# EAGLE design pcb_univ_3-2-(1-2)-x-rev2 (EAGLE 7.5.0)
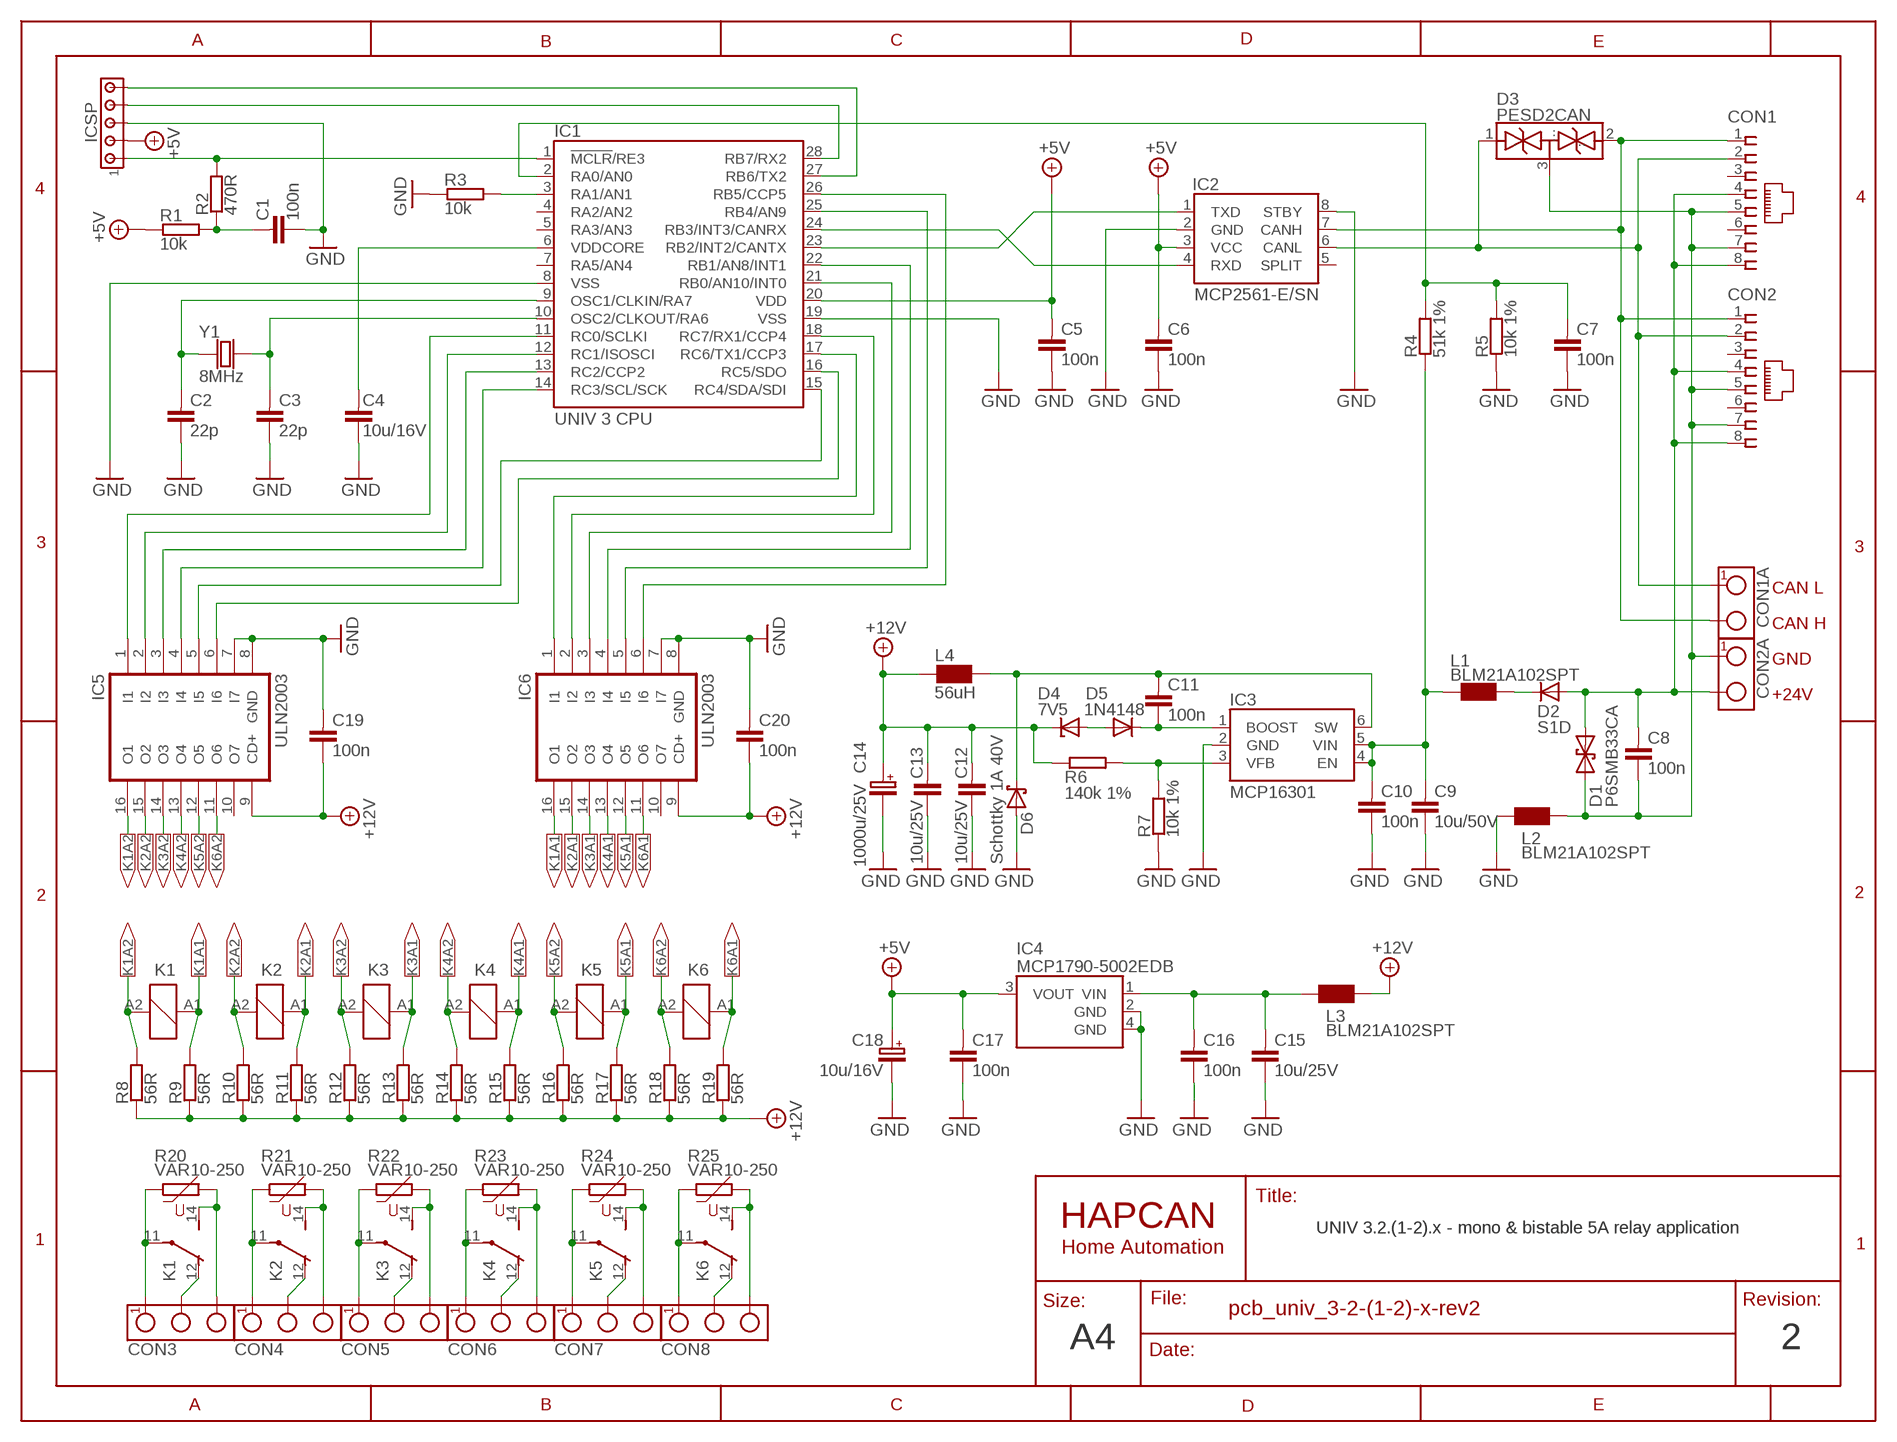
[diagram p0: schematic, sheet 1]
FRAME (HAP_A4): AUTHOR: hapcan.com

## Parts
C1  100n  CAPACITOR0805  [0805]
C2  22p  CAPACITOR0805  [0805]
C3  22p  CAPACITOR0805  [0805]
C4  10u/16V  CAPACITOR0805  [0805]
C5  100n  CAPACITOR0805  [0805]
C6  100n  CAPACITOR0805  [0805]
C7  100n  CAPACITOR0805  [0805]
C8  100n  CAPACITOR0805  [0805]
C9  10u/50V  CAPACITOR1210  [1210]
C10  100n  CAPACITOR0805  [0805]
C11  100n  CAPACITOR0805  [0805]
C12  10u/25V  CAPACITOR1206  [1206]
C13  10u/25V  CAPACITOR1206  [1206]
C14  1000u/25V  CAPACITOR-POLARIZED-5X10.5  [CAP-5X10.5]
C15  10u/25V  CAPACITOR1206  [1206]
C16  100n  CAPACITOR0805  [0805]
C17  100n  CAPACITOR0805  [0805]
C18  10u/16V  CAPACITOR-POLARIZED-SMC_B  [SMC_B]
C19  100n  CAPACITOR0805  [0805]
C20  100n  CAPACITOR0805  [0805]
CON1  RJ45-SOCKET  [RJ45-PCB-SOCKET]
CON1A  TERMINAL-2  TERMINAL-2-5X10,5MM  [ARK2-5X10,5MM]
CON2  RJ45-SOCKET  [RJ45-PCB-SOCKET]
CON2A  TERMINAL-2  TERMINAL-2-5X10,5MM  [ARK2-5X10,5MM]
CON3  TERMINAL-3-5X10.5MM  [ARK3-5X10.5MM]
CON4  TERMINAL-3-5X10.5MM  [ARK3-5X10.5MM]
CON5  TERMINAL-3-5X10.5MM  [ARK3-5X10.5MM]
CON6  TERMINAL-3-5X10.5MM  [ARK3-5X10.5MM]
CON7  TERMINAL-3-5X10.5MM  [ARK3-5X10.5MM]
CON8  TERMINAL-3-5X10.5MM  [ARK3-5X10.5MM]
D1  P6SMB33CA  DIODE_TRANSIL2  [DO-214_TRANSIL2]
D2  S1D  DIODE_DO-214  [DO-214]
D3  PESD2CAN  PESD2CANSOT-23  [SOT-23]
D4  7V5  DIODE_ZENER_SOD-80  [SOD-80]
D5  1N4148  DIODE_0805  [0805]
D6  Schottky 1A 40V  DIODE_TRANSIL1_DO214  [DO-214]
IC1  UNIV 3 CPU  UNIV3CPU-I/SO  [UNIV3CPU]
IC2  MCP2561-E/SN  [SO-08]
IC3  MCP16301  MCP16301SOT23-6  [SOT-23-6]
IC4  MCP1790-5002EDB  MCP1826SOT223-3  [SOT-223]
IC5  ULN2003  [SO-16]
IC6  ULN2003  [SO-16]
ICSP  HEADER5  [SIP-5]
K1  RELAY_PE  [RELAY_PE]
K2  RELAY_PE  [RELAY_PE]
K3  RELAY_PE  [RELAY_PE]
K4  RELAY_PE  [RELAY_PE]
K5  RELAY_PE  [RELAY_PE]
K6  RELAY_PE  [RELAY_PE]
L1  BLM21A102SPT  CHOKE0805  [0805]
L2  BLM21A102SPT  CHOKE0805  [0805]
L3  BLM21A102SPT  CHOKE0805  [0805]
L4  56uH  CHOKEDER0705  [CHOKE-DER0705]
R1  10k  RESISTOR0805  [0805]
R2  470R  RESISTOR0805  [0805]
R3  10k  RESISTOR0805  [0805]
R4  51k 1%  RESISTOR0805  [0805]
R5  10k 1%  RESISTOR0805  [0805]
R6  140k 1%  RESISTOR0805  [0805]
R7  10k 1%  RESISTOR0805  [0805]
R8  56R  RESISTOR1206  [1206]
R9  56R  RESISTOR1206  [1206]
R10  56R  RESISTOR1206  [1206]
R11  56R  RESISTOR1206  [1206]
R12  56R  RESISTOR1206  [1206]
R13  56R  RESISTOR1206  [1206]
R14  56R  RESISTOR1206  [1206]
R15  56R  RESISTOR1206  [1206]
R16  56R  RESISTOR1206  [1206]
R17  56R  RESISTOR1206  [1206]
R18  56R  RESISTOR1206  [1206]
R19  56R  RESISTOR1206  [1206]
R20  VAR10-250  VARISTOR7.5MM-1  [VARISTOR1]
R21  VAR10-250  VARISTOR7.5MM-1  [VARISTOR1]
R22  VAR10-250  VARISTOR7.5MM-1  [VARISTOR1]
R23  VAR10-250  VARISTOR7.5MM-1  [VARISTOR1]
R24  VAR10-250  VARISTOR7.5MM-1  [VARISTOR1]
R25  VAR10-250  VARISTOR7.5MM-1  [VARISTOR1]
Y1  8MHz  CRYSTAL-HC49V  [CRYSTAL-HC49V]

## Nets
+5V: C5.1 C6.1 C17.1 C18.+ IC1.20(VDD) IC2.3(VCC) IC4.3(VOUT) ICSP.2 R1.1
+12V: C12.1 C13.1 C14.+ C19.2 C20.2 D4.C IC5.9(CD+) IC6.9(CD+) L3.2 L4.1 R6.1 R8.1 R9.1 R10.1 R11.1 R12.1 R13.1 R14.1 R15.1 R16.1 R17.1 R18.1 R19.1
GND: C1.2 C2.2 C3.2 C4.2 C5.2 C6.2 C7.2 C9.2 C10.2 C12.2 C13.2 C14.- C15.2 C16.2 C17.2 C18.- C19.1 C20.1 D6.A IC1.8(VSS) IC1.19(VSS) IC2.2(GND) IC2.8(STBY) IC3.2(GND) IC4.2(GND) IC4.4(GND) IC5.7(I7) IC5.8(GND) IC6.7(I7) IC6.8(GND) ICSP.3 L2.1 R3.1 R5.1 R7.1
K1A1: IC6.16(O1) K1.A1 R9.2
K1A2: IC5.16(O1) K1.A2 R8.2
K2A1: IC6.15(O2) K2.A1 R11.2
K2A2: IC5.15(O2) K2.A2 R10.2
K3A1: IC6.14(O3) K3.A1 R13.2
K3A2: IC5.14(O3) K3.A2 R12.2
K4A1: IC6.13(O4) K4.A1 R15.2
K4A2: IC5.13(O4) K4.A2 R14.2
K5A1: IC6.12(O5) K5.A1 R17.2
K5A2: IC5.12(O5) K5.A2 R16.2
K6A1: IC6.11(O6) K6.A1 R19.2
K6A2: IC5.11(O6) K6.A2 R18.2
N$1: D2.C L1.2
N$2: IC1.24(RB3/INT3/CANRX) IC2.4(RXD)
N$3: IC1.23(RB2/INT2/CANTX) IC2.1(TXD)
N$4: CON1.1 CON1A.2 CON2.1 D3.2(..) IC2.7(CANH)
N$5: C9.1 C10.1 IC3.4(EN) IC3.5(VIN) L1.1 R4.1
N$6: C15.1 C16.1 IC4.1(VIN) L3.1
N$7: C1.1 R1.2 R2.1
N$8: IC1.1(!MCLR!/RE3) ICSP.1 R2.2
N$9: C8.1 CON1.4 CON1.8 CON2.4 CON2.8 CON2A.2 D1.C D2.A
N$10: IC1.28(RB7/RX2) ICSP.4
N$11: IC1.12(RC1/ISOSCI) IC5.2(I2)
N$12: IC1.3(RA1/AN1) R3.2
N$13: C8.2 CON1.5 CON1.7 CON2.5 CON2.7 CON2A.1 D1.A D3.3(...) L2.2
N$14: IC1.27(RB6/TX2) ICSP.5
N$15: C3.1 IC1.10(OSC2/CLKOUT/RA6) Y1.2
N$16: C7.1 IC1.2(RA0/AN0) R4.2 R5.2
N$17: C11.1 D6.C IC3.6(SW) L4.2
N$18: IC1.11(RC0/SCLKI) IC5.1(I1)
N$19: IC1.13(RC2/CCP2) IC5.3(I3)
N$20: IC3.3(VFB) R6.2 R7.2
N$21: CON3.2 K1.12(2:NC)
N$22: IC1.14(RC3/SCL/SCK) IC5.4(I4)
N$23: D4.A D5.2(A)
N$24: IC1.15(RC4/SDA/SDI) IC5.5(I5)
N$25: CON4.2 K2.12(2:NC)
N$26: CON5.2 K3.12(2:NC)
N$27: CON1.2 CON1A.1 CON2.2 D3.1(.) IC2.6(CANL)
N$28: CON6.2 K4.12(2:NC)
N$29: CON7.2 K5.12(2:NC)
N$30: CON3.1 K1.11(2:COM) R20.1
N$31: CON8.2 K6.12(2:NC)
N$32: CON3.3 K1.14(2:NO) R20.2
N$38: C11.2 D5.1(C) IC3.1(BOOST)
N$40: C2.1 IC1.9(OSC1/CLKIN/RA7) Y1.1
N$45: IC1.16(RC5/SDO) IC5.6(I6)
N$46: IC1.17(RC6/TX1/CCP3) IC6.1(I1)
N$47: IC1.18(RC7/RX1/CCP4) IC6.2(I2)
N$51: CON4.3 K2.14(2:NO) R21.2
N$52: CON5.3 K3.14(2:NO) R22.2
N$53: CON6.3 K4.14(2:NO) R23.2
N$54: CON7.3 K5.14(2:NO) R24.2
N$55: CON8.3 K6.14(2:NO) R25.2
N$56: C4.1 IC1.6(VDDCORE)
N$57: CON4.1 K2.11(2:COM) R21.1
N$58: CON5.1 K3.11(2:COM) R22.1
N$59: CON6.1 K4.11(2:COM) R23.1
N$60: CON7.1 K5.11(2:COM) R24.1
N$61: CON8.1 K6.11(2:COM) R25.1
N$63: IC1.21(RB0/AN10/INT0) IC6.3(I3)
N$64: IC1.22(RB1/AN8/INT1) IC6.4(I4)
N$65: IC1.25(RB4/AN9) IC6.5(I5)
N$66: IC1.26(RB5/CCP5) IC6.6(I6)
Unconnected: CON1.3 CON1.6 CON2.3 CON2.6 IC1.4(RA2/AN2) IC1.5(RA3/AN3) IC1.7(RA5/AN4) IC2.5(SPLIT) IC5.10(O7) IC6.10(O7)

## Notes on the sheet
- CAN L
- CAN H
- GND
- +24V
- UNIV 3.2.(1-2).x - mono & bistable 5A relay application
- A4 | 2

## Library data of the parts
C1-C13 C15-C17 C19 C20 = HAPCAN_devices - UNIV3:CAPACITOR: HAPCAN Capacitor
C14 C18 = HAPCAN_devices - UNIV3:CAPACITOR-POLARIZED: HAPCAN Polarazied Capacitor
CON1 CON2 = HAPCAN_devices - UNIV3:RJ45-SOCKET: HAPCAN RJ45 socket
CON1A CON2A = HAPCAN_devices - UNIV3:TERMINAL-2: HAPCAN Terminal Block - 2 way
CON3-CON8 = HAPCAN_devices - UNIV3:TERMINAL-3: HAPCAN Terminal Block - 3 way
D1 = HAPCAN_devices - UNIV3:DIODE_TRANSIL2: HAPCAN Bidirectional transil diode
D2 D5 = HAPCAN_devices - UNIV3:DIODE: HAPCAN Rectifier Diode
D3 = HAPCAN_devices - UNIV3:PESD2CAN: CAN bus ESD protection diode
D4 = HAPCAN_devices - UNIV3:DIODE_ZENER: HAPCAN ZENER DIODE
D6 = HAPCAN_devices - UNIV3:DIODE_TRANSIL1: HAPCAN Unidirectional transil diode
IC1 = HAPCAN_devices - UNIV3:UNIV3CPU: HAPCAN Microcontroller UNIV 3 CPU
IC2 = HAPCAN_devices - UNIV3:MCP2561: HAPCAN CAN Tranceiver
IC3 = HAPCAN_devices - UNIV3:MCP16301: High Voltage Input Integrated Switch Step-Down Regulator
IC4 = HAPCAN_devices - UNIV3:MCP1826: 1000 mA, Low Voltage, Low Quiescent Current LDO Regulator
IC5 IC6 = HAPCAN_devices - UNIV3:ULN2003: HAPCAN 7 channel Darlington Array NPN 50V 0.5A
ICSP = HAPCAN_devices - UNIV3:HEADER5: HAPCAN Header 5
K1-K6 = HAPCAN_devices - UNIV3:RELAY_PE: HAPCAN Monostable relay 5A
L1-L4 = HAPCAN_devices - UNIV3:CHOKE: Choke
R1-R19 = HAPCAN_devices - UNIV3:RESISTOR: HAPCAN Resistor
R20-R25 = HAPCAN_devices - UNIV3:VARISTOR: HAPCAN Varistor
Y1 = HAPCAN_devices - UNIV3:CRYSTAL: HAPCAN Crystal

## Board
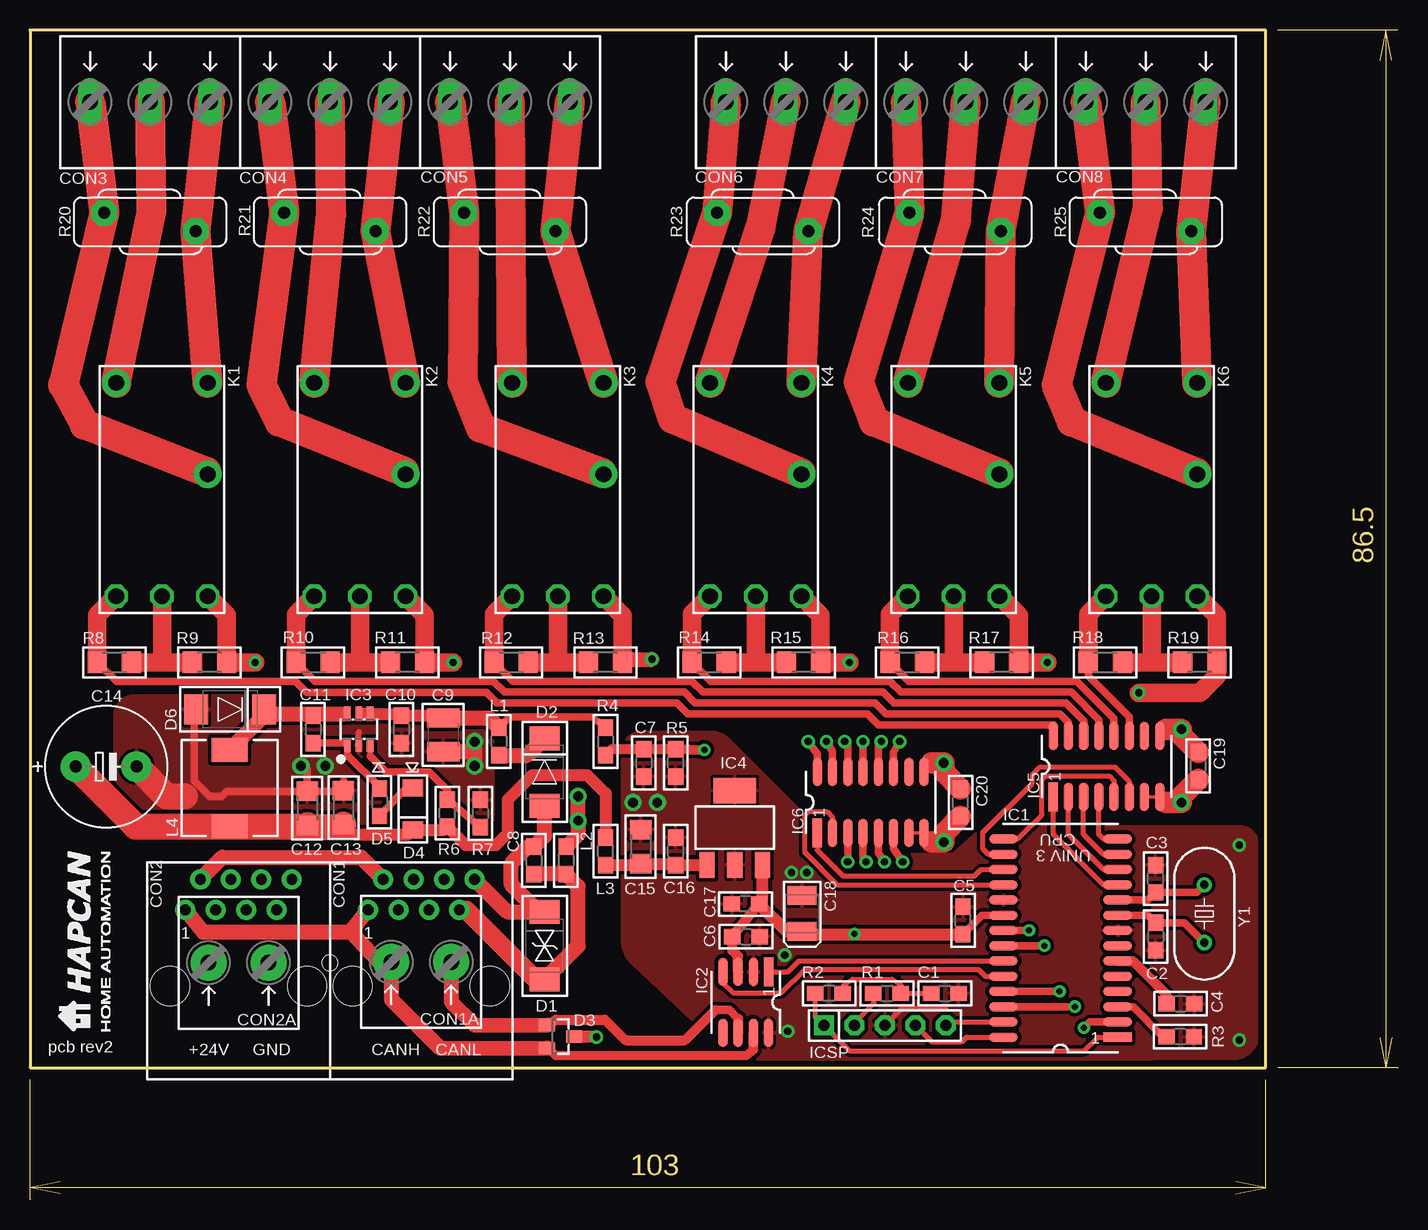
[diagram p1: board, top side]
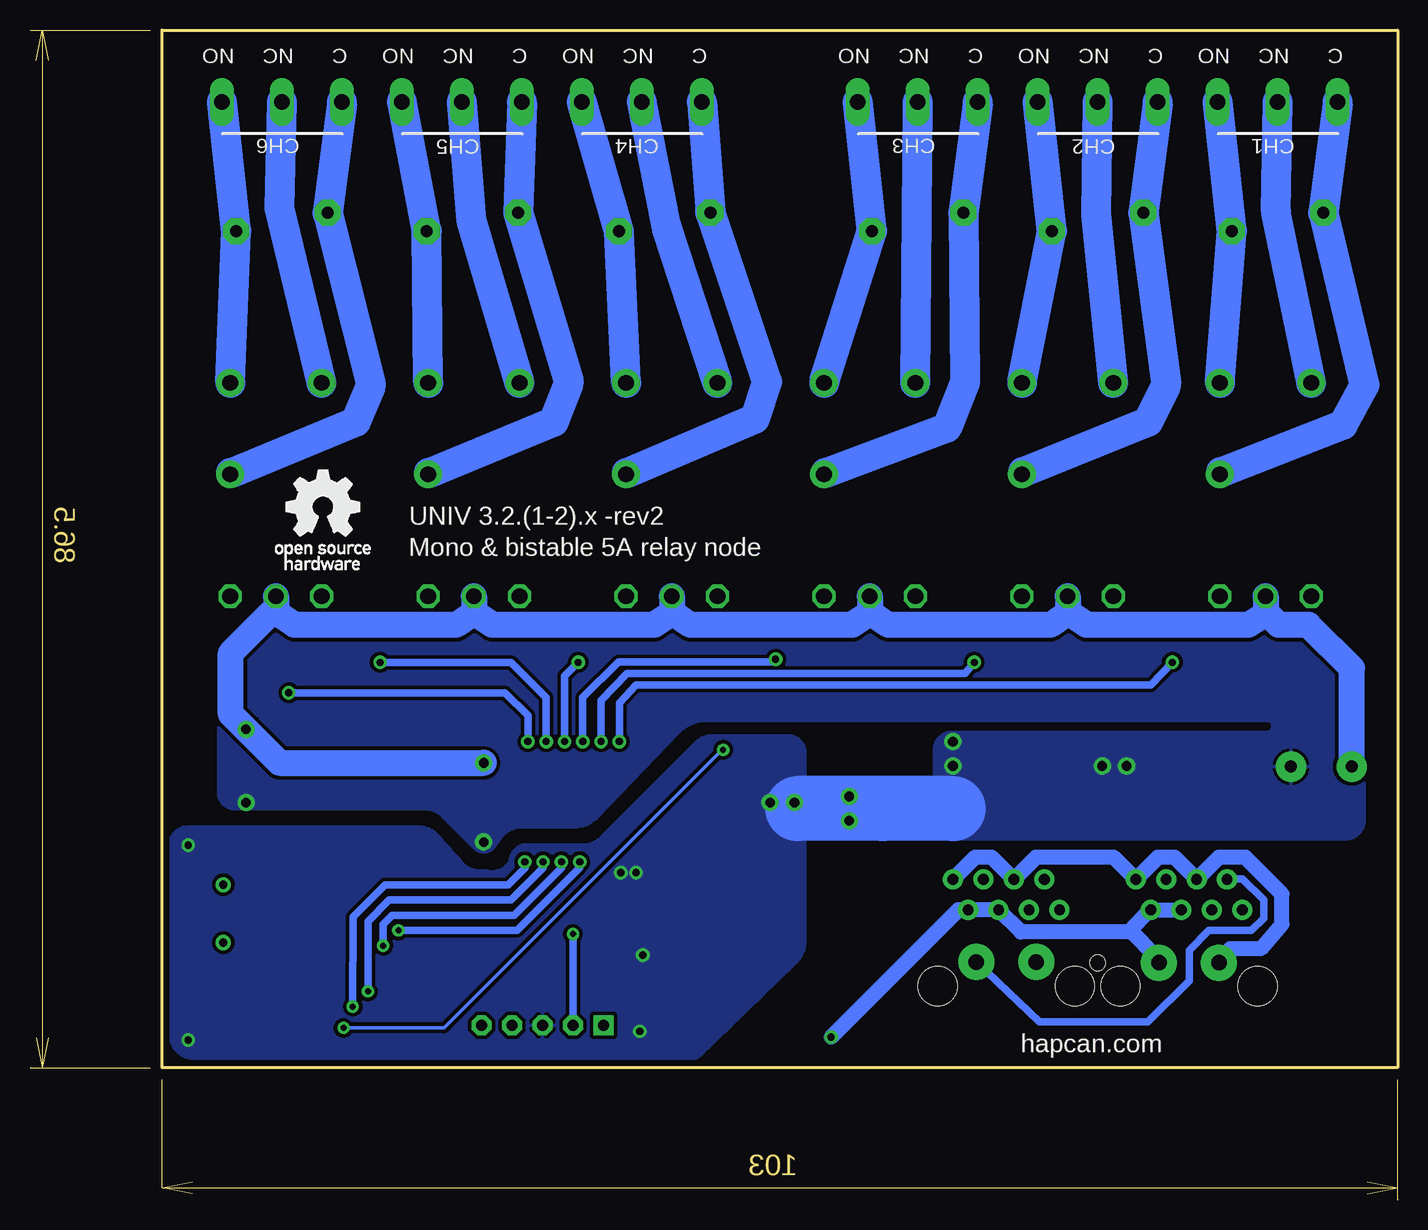
[diagram p2: board, bottom side, seen from below]

Size 114 x 97.5 mm. Coordinates in mm from the lower left corner, seen from the top.
Outline: 113.99,11 114,11 113,11
Outline: 113,11 104,11
Outline: 113,97.5 113,11
Outline: 114,97.5 113,97.5
Outline: 113,97.5 104,97.5
Outline: 113.5,95 113,97.5
Outline: 112.5,13.5 113,11
Outline: 113,97.5 112.5,95
Outline: 113.5,13.5 113,11
Outline: 0,0.01 0,0 0,1
Outline: 0,1 0,10
Outline: 103,1 0,1
Outline: 103,1 103,10
Outline: 100.5,0.5 103,1
Outline: 2.5,1.5 0,1
Outline: 103,1 100.5,1.5
Outline: 2.5,0.5 0,1
Outline: 0,11 103,11 103,97.5 0,97.5 0,11
Copper layers (1*16): Top 0.07mm / dielectric 1.5mm / Bottom 0.07mm
Design rules "hapcan_drc *": minimum track width 12mil, minimum drill 0.5mm, track to track 12mil, track to pad 12mil, pad to pad 12mil, via to via 12mil, smd to smd 12mil, copper to edge 20mil, drill to drill 10mil, minimum pad ring 10mil, minimum via ring 10mil, stop-mask expansion 4mil, vias tented up to drill 0mil, thermal gap 10mil
Holes 1.3 mm at 25,19.74
tKeepout: 34 lines

### Footprints (pad centres in the part's own frame; a part is rotated, then mirrored left to right if it is on the bottom)
0805 = smd 1.372 x 1.27: 1 -1.143,0; 2 1.143,0
1210 = smd 1.6 x 2.7: 1 -1.4,0; 2 1.4,0
1206 = smd 1.6 x 1.803: 1 -1.422,0; 2 1.422,0
CAP-5X10.5 = drill 1 pad 2.54: + -2.54,0; - 2.54,0
SMC_B = smd 1.6 x 2.4: + -1.5,0; - 1.5,0
RJ45-PCB-SOCKET = drill 0.9 pad 1.676: 1 -4.445,6.35; 2 -3.175,8.89; 3 -1.905,6.35; 4 -0.635,8.89; 5 0.635,6.35; 6 1.905,8.89; 7 3.175,6.35; 8 4.445,8.89 | hole 3.251: -5.715,0; 5.715,0
ARK2-5X10,5MM = drill 1.3 pad 3: 1 -2.5,0; 2 2.5,0
ARK3-5X10.5MM = drill 1.3 pad 2 long: 1 -5,0; 2 0,0; 3 5,0
DO-214_TRANSIL2 = smd 2 x 2.5: A 2.82,0; C -2.82,0
DO-214 = smd 2 x 2.5: A 2.82,0; C -2.82,0
SOT-23 = smd 1.016 x 1.321: 1 -0.965,-1.118; 2 0.965,-1.118; 3 0,1.118
SOD-80 = smd 1.4 x 1.7: A 1.75,0; C -1.75,0
UNIV3CPU = smd 2.4 x 0.8: 1 -4.763,8.255; 2 -4.763,6.985; 3 -4.763,5.715; 4 -4.763,4.445; 5 -4.763,3.175; 6 -4.763,1.905; 7 -4.763,0.635; 8 -4.763,-0.635; 9 -4.763,-1.905; 10 -4.763,-3.175; 11 -4.763,-4.445; 12 -4.763,-5.715; 13 -4.763,-6.985; 14 -4.763,-8.255; 15 4.763,-8.255; 16 4.763,-6.985; 17 4.763,-5.715; 18 4.763,-4.445; 19 4.763,-3.175; 20 4.763,-1.905; 21 4.763,-0.635; 22 4.763,0.635; 23 4.763,1.905; 24 4.763,3.175; 25 4.763,4.445; 26 4.763,5.715; 27 4.763,6.985; 28 4.763,8.255
SO-08 = smd 2.4 x 0.8: 1 -2.54,1.905; 2 -2.54,0.635; 3 -2.54,-0.635; 4 -2.54,-1.905; 5 2.54,-1.905; 6 2.54,-0.635; 7 2.54,0.635; 8 2.54,1.905
SOT-23-6 = smd 0.55 x 1.2: 1 -0.95,-1.3; 2 0,-1.3; 3 0.95,-1.3; 4 0.95,1.3; 5 0.003,1.3; 6 -0.95,1.3
SOT-223 = smd 1.27 x 2.159: 1 -2.311,-3.099; 2 0,-3.099; 3 2.311,-3.099 | smd 3.556 x 2.159: 4 0,3.099
SO-16 = smd 2.4 x 0.8: 1 -2.54,4.445; 2 -2.54,3.175; 3 -2.54,1.905; 4 -2.54,0.635; 5 -2.54,-0.635; 6 -2.54,-1.905; 7 -2.54,-3.175; 8 -2.54,-4.445; 9 2.54,-4.445; 10 2.54,-3.175; 11 2.54,-1.905; 12 2.54,-0.635; 13 2.54,0.635; 14 2.54,1.905; 15 2.54,3.175; 16 2.54,4.445
SIP-5 = drill 0.9 pad 1.676 square: 1 -5.08,0 | drill 0.9 pad 1.676 octagon: 2 -2.54,0; 3 0,0; 4 2.54,0; 5 5.08,0
RELAY_PE = drill 1.3 pad 2.3: 11 -1.27,3.81; 12 -8.89,-3.81; 14 -8.89,3.81 | drill 1.3 octagon: A1 8.89,3.81; A2 8.89,-3.81
CHOKE-DER0705 = smd 2 x 3: 1 -3.2,0; 2 3.2,0
VARISTOR1 = drill 1 pad 2.184 octagon: 1 -0.762,-3.81; 2 0.762,3.81
CRYSTAL-HC49V = drill 0.7 pad 1.27: 1 -2.413,0; 2 2.413,0

### Placement (x,y rotation side)
C1  76.27,17.19 0 top
C2  93.83,21.92 270 top
C3  93.83,26.75 90 top
C4  95.91,16.33 0 top
C5  77.78,23.27 90 top
C6  59.69,21.92 0 top
C7  51.16,36.4 270 top
C8  42.01,28.26 270 top
C9  34.44,38.74 270 top
C10  30.96,39.19 270 top
C11  23.6,39.19 270 top
C12  23.12,32.62 90 top
C13  26.14,32.67 90 top
C14  6.35,36.08 0 top
C15  50.9,29.41 90 top
C16  53.82,29.03 90 top
C17  59.65,24.64 180 top
C18  64.36,23.85 90 top
C19  97.39,36.15 90 top
C20  77.57,33.1 90 top
CON1  32.62,17.8 0 top
CON1A  32.62,19.8 180 top
CON2  17.38,17.8 0 top
CON2A  17.38,19.74 180 top
CON3  10,91.5 0 top
CON4  25,91.5 0 top
CON5  40,91.5 0 top
CON6  63,91.5 0 top
CON7  78,91.5 0 top
CON8  93,91.5 0 top
D1  42.9,21.16 270 top
D2  42.9,35.64 270 top
D3  44.22,13.58 270 top
D4  31.9,32.56 90 top
D5  29.14,33.12 270 top
D6  16.69,40.87 180 top
IC1  85.9,21.8 180 top
IC2  59.67,16.44 270 top
IC3  27.41,39.19 0 top
IC4  58.75,30.99 0 top
IC5  89.74,36.1 90 top
IC6  70.08,33.1 90 top
ICSP  71.27,14.52 0 top
K1  11,59.19 270 top
K2  27.5,59.19 270 top
K3  44,59.19 270 top
K4  60.5,59.19 270 top
K5  77,59.19 270 top
K6  93.5,59.19 270 top
L1  39.09,38.18 270 top
L2  44.68,28.27 270 top
L3  47.98,29.03 90 top
L4  16.64,34.29 90 top
R1  71.45,17.19 0 top
R2  66.62,17.19 180 top
R3  95.88,13.58 180 top
R4  47.98,38.18 270 top
R5  53.82,36.4 90 top
R6  34.8,32.21 90 top
R7  37.54,32.18 270 top
R8  7.04,44.78 180 top
R9  14.96,44.78 0 top
R10  23.6,44.78 180 top
R11  31.47,44.78 0 top
R12  40.11,44.78 180 top
R13  47.98,44.78 0 top
R14  56.62,44.78 180 top
R15  64.49,44.78 0 top
R16  73.13,44.78 180 top
R17  81,44.78 0 top
R18  89.64,44.78 180 top
R19  97.51,44.78 0 top
R20  10,81.5 270 top
R21  25,81.5 270 top
R22  40,81.5 270 top
R23  61.1,81.5 270 top
R24  77.11,81.5 270 top
R25  93,81.5 270 top
Y1  97.89,23.83 90 top

### Tracks (layer width: path | path; a pad name or v marks a point on that pad's centre or on a via)
+5V  (via drill 0.5 pad 1.02)
  Top 0.406: ICSP.2 68.73,14.7 70.36,16.33 70.36,17.13 R1.1
  Top 0.61: IC1.20 79.36,23.7 C5.1 | 68.61,22.12 v68.73,22.12
  Top 0.813: C17.1 C6.1 58.55,20.76 59.03,20.27 IC2.3
  Top 1.016: C5.1 v68.73,22.12 | 68.61,22.12 64.59,22.12 C18.+ 63.09,22.35 C17.1 61.06,24.91 IC4.3
  Bottom 0.61: v68.73,22.12 ICSP.2
+12V  (via drill 0.8 pad 1.42, 1.3)
  Top 0.305: 75.16,36.4 74.53,35.77 IC6.9 | 94.69,39.19 94.19,38.69 IC5.9
  Top 1.016: C13.1 27.08,30.43 31.47,30.43 31.98,30.82 D4.C 34.55,30.82 R6.1 36.32,29.54 38.84,29.54 39.85,30.56 39.85,33.35 41.89,35.38 46.46,35.38 47.98,33.86 L3.2
  Top 1.524: 10.95,44.78 R8.1 | 10.95,44.78 R9.1 | 27.71,44.78 R10.1 | 27.71,44.78 R11.1 | 44.17,44.78 R12.1 44,44.78 v44,50.3 | 44.17,44.78 R13.1 | 60.63,44.78 R14.1 60.5,44.78 v60.5,50.3 | 60.63,44.78 R15.1 | 76.79,44.78 R16.1 | 76.79,44.78 R17.1 | 10.95,44.78 11,44.83 v11,50.3 | 27.71,44.78 27.5,44.99 v27.5,50.3 | 44,44.95 44.17,44.78 | 60.5,44.91 60.63,44.78 | 76.79,44.78 77,45 v77,50.3 | R18.1 93.45,44.78 | 93.45,44.78 R19.1 | v93.5,50.3 93.5,44.83 93.45,44.78
  Top 1.778: C20.2 76.18,35.66 v76.18,36.4 75.16,36.4 | C19.2 95.99,38.69 v95.99,39.19 94.69,39.19
  Top 2.184: C14.+ 8.8,31.09 L4.1 23.01,31.09 C12.1 23.24,31.07 25.96,31.07 C13.1
  Bottom 1.27: 10.92,48.93 11,48.85
  Bottom 1.524: 11.18,48.67 11,48.85
  Bottom 2.184: 93.18,48.73 91.95,47.91 78.49,47.91 76.96,48.93 | 93.18,48.73 93.47,48.93 | 76.96,48.93 75.44,47.91 61.98,47.91 60.45,48.93 | 60.45,48.93 58.93,47.91 45.47,47.91 43.94,48.93 | 43.94,48.93 42.42,47.91 28.96,47.91 27.43,48.93 | 27.43,48.93 25.91,47.91 12.45,47.91 11.18,48.67 | v76.18,36.4 93.19,36.4 v95.99,39.19 97.26,40.46 97.26,45.54 93.88,48.93 93.47,48.93 | 43.94,48.93 44,48.98 v44,50.3 | 60.45,48.93 60.5,48.97 v60.5,50.3 | 93.47,48.93 93.5,48.95 | 76.96,48.93 77,48.96 v77,50.3 | 27.43,48.93 27.5,48.99 v27.5,50.3 | C14.+ 3.81,44.3 7.42,47.91 9.91,47.91 10.92,48.93 11,49 v11,50.3 | v93.5,50.3 93.5,49.05 93.18,48.73
GND  (via drill 0.6, 0.8 pad 1.42)
  Top 0.305: 75.16,29.8 74.53,30.43 IC6.8 IC6.7 | 94.69,33.1 94.19,33.61 IC5.8 IC5.7
  Top 0.406: C1.2 77.42,17.04 | 76.33,15.95 72.7,15.95 ICSP.3
  Top 0.508: IC3.2 27.41,38.94
  Top 0.61: C12.2 26.09,34.04 C13.2 26.14,34.88 | D6.A 13.69,40.19 13.69,34.88 14.96,33.61 15.98,33.61 16.41,34.04 C12.2 | v22.58,36.15 23.11,35.87 C12.2
  Top 1.27: L2.1 45.7,30.43 v45.7,31.57 v45.7,33.61 | 37.06,37.67 v37.06,38.18 | 37.06,37.67 v37.06,36.15 | C9.2 36.73,37.34 37.06,37.67
  Top 1.778: C20.1 76.18,30.53 v76.18,29.8 75.16,29.8 | C19.1 95.99,33.61 v95.99,33.1 94.69,33.1
  Top 2.184: C14.- 11.37,33.61 12.93,33.61
  Bottom 0.508: 42.9,32.59 v45.7,31.57
  Bottom 3.81: 50.01,32.59 50.27,32.84 v50.27,33.1
  Bottom 5.4: 37.06,32.59 42.9,32.59 50.01,32.59
  other vias: 24.61,36.15 62.92,20.37 64.75,27.26 63.48,27.26 100.81,29.54 100.81,13.29 52.3,33.1 63.17,14.02
  pour Top (isolate 0.305): 102.34,14.05 102.34,29.29 arc90 101.07,31.07 79.48,31.07 76.94,28.78 67.79,28.78 58.4,38.18 arc45 56.87,38.94 50.78,38.94 arc90 49.38,37.16 49.38,21.67 arc45 50.27,19.64 58.9,11.51 100.56,11.76 arc90
  pour Bottom (isolate 0.305): 102.34,13.79 102.34,29.54 arc90 100.81,31.07 82.02,31.07 arc45 80.24,30.56 77.95,28.02 arc-45 76.56,27.38 75.92,27.38 arc-90 73.89,28.53 arc90 72.37,29.54 67.79,29.54 arc-45 66.27,30.3 58.4,38.18 arc45 56.87,38.66 50.78,38.66 arc90 49.38,37.16 49.38,21.67 arc45 50.27,19.64 58.14,12.02 arc45 60.68,11.25 100.31,11.76 arc90
  pour Bottom (isolate 0.305): 38.58,37.42 38.58,31.07 arc-90 37.31,30.05 12.68,30.05 arc-90 11.15,31.32 11.15,37.42 arc-90 12.93,38.94 37.31,38.94 arc-90
  pour Top (isolate 0.305): 12.17,30.05 arc-90 11.15,31.07 7.09,32.34 7.09,40.21 arc-90 8.61,41.99 36.3,41.99 arc-90 38.58,39.7 38.58,32.08 arc-90 36.55,30.05
  pour Bottom (isolate 0.305): 2.77,47.58 arc-90 4.55,48.85 97,48.85 arc-90 98.27,47.58 98.27,33.76 arc-90 96.75,32.59 81,32.59 arc45 79.48,31.83 76.94,29.29 arc-90 75.41,29.29 arc-5 74.65,30.3 arc45 73.13,31.07 68.81,31.07 arc-45 66.78,31.83 59.92,38.94 arc45 57.63,39.96 10.9,39.96 arc180 10.9,38.94 12.68,38.94 12.68,30.05 4.29,30.05 arc-90 2.77,31.83
K1A1  (via drill 0.6)
  Top 0.406: K1.A1
  Top 0.61: IC6.16 65.64,37.16 v64.87,38.18
  Top 1.524: v18.77,44.78 R9.2 16.38,48.73 K1.A1
  Bottom 0.61: v64.87,38.18 64.87,41.4 63.48,42.9 20.55,42.9 v18.77,44.78
K1A2
  Top 0.406: K1.A2
  Top 0.61: IC5.16 85.29,39.55 70.74,39.55 69.83,40.46 54.84,40.46 53.93,41.38 38.94,41.38 38.05,42.27 23.07,42.27 22.15,43.18 7.21,43.18 R8.2
  Top 1.524: R8.2 5.62,48.73 K1.A2
K2A1  (via drill 0.6, 0.6 pad 1.02)
  Top 0.406: K2.A1
  Top 0.61: IC6.15 66.91,37.34 v66.4,38.18
  Top 1.524: v35.28,44.78 R11.2 32.89,48.72 K2.A1
  Bottom 0.61: v66.4,38.18 66.4,41.61 64.24,43.87 36.04,43.87 v35.28,44.78
K2A2
  Top 0.406: K2.A2
  Top 0.61: IC5.15 86.56,39.75 85.85,40.46 71.35,40.46 70.44,41.38 55.45,41.38 54.56,42.29 39.58,42.29 38.66,43.18 23.78,43.18 R10.2
  Top 1.524: R10.2 22.18,48.79 K2.A2
K3A1  (via drill 0.6, 0.6 pad 1.02)
  Top 0.406: K3.A1
  Top 0.61: IC6.14 68.17,37.92 v67.92,38.18
  Top 1.27: R13.2 49.66,45.04 v51.84,45.04
  Top 1.524: R13.2 49.4,48.71 K3.A1
  Bottom 0.61: v51.84,45.04 51.79,44.83 64.95,44.83 67.92,41.86 v67.92,38.18
K3A2
  Top 0.406: K3.A2
  Top 0.61: IC5.14 87.83,38.88 87.83,39.88 86.34,41.38 72.01,41.38 71.12,42.29 56.09,42.29 55.17,43.21 40.29,43.21 R12.2
  Top 1.524: R12.2 38.69,48.8 K3.A2
K4A1  (via drill 0.6, 0.6 pad 1.02)
  Top 0.406: K4.A1
  Top 0.61: IC6.13 v69.44,38.18
  Top 1.524: v68.3,44.78 R15.2 65.91,48.7 K4.A1
  Bottom 0.61: v69.44,38.18 69.44,43.64 v68.3,44.78
K4A2
  Top 0.406: K4.A2
  Top 0.61: IC5.13 89.11,38.88 89.11,39.98 86.79,42.29 72.62,42.29 71.71,43.21 56.77,43.21 R14.2
  Top 1.524: R14.2 55.2,48.81 K4.A2
K5A1  (via drill 0.6, 0.6 pad 1.02)
  Top 0.406: K5.A1
  Top 0.61: IC6.12 70.72,37.92 v70.97,38.18
  Top 1.524: K5.A1 82.42,48.69 R17.2 v84.81,44.78
  Bottom 0.61: v70.97,38.18 70.97,41.86 73.89,44.78 v84.81,44.78
K5A2
  Top 0.406: K5.A2
  Top 0.61: R16.2 73.25,43.21 87.25,43.21 90.37,40.08 IC5.12
  Top 1.524: R16.2 71.71,48.82 K5.A2
K6A1  (via drill 0.6, 0.6 pad 1.02)
  Top 0.406: K6.A1
  Top 0.61: IC6.11 71.98,37.29 v72.49,38.18
  Top 1.524: K6.A1 98.93,48.68 R19.2 98.93,43.66 97.51,42.24 v92.43,42.24
  Bottom 0.61: v72.49,38.18 72.49,40.34 74.4,42.24 v92.43,42.24
K6A2
  Top 0.406: K6.A2
  Top 0.61: IC5.11 91.64,40.24 88.22,43.66 R18.2
  Top 1.524: R18.2 88.22,48.83 K6.A2
N$1
  Top 1.27: L1.2 41.48,37.03 D2.C
N$2
  Top 0.406: IC1.24 79.63,18.62 79.07,19.18 64.59,19.18 62.61,17.25 58.6,17.25 57.76,18.04 IC2.4
N$3
  Top 0.406: IC1.23 64.09,19.89 63.17,18.98 IC2.1
N$4
  Top 0.737: 43.84,12.02 59.72,12.02
  Top 0.762: 59.72,12.02 60.3,12.5 | D3.2 43.84,12.02
  Top 0.813: 60.3,12.5 IC2.7
  Top 1.27: 26.71,22.3 CON1.1 | 26.71,22.3 14.4,22.3 CON2.1 | 26.71,22.3 29.08,19.8 CON1A.2 30.12,16.67 34.16,12.63 D3.2
N$5
  Top 0.305: 27.69,40.49 IC3.5
  Top 0.61: R4.1 46.84,40.21 39.98,40.21 L1.1
  Top 1.016: C10.1 30.88,40.42 | 34.27,40.31 C9.1 34.24,40.34 C10.1 | C10.1 30.81,40.49 IC3.4 27.69,40.49
  Top 1.27: C9.1 38.28,40.14 L1.1
N$6
  Top 0.61: C16.1 53.62,27.89
  Top 1.016: L3.1 50.8,27.89 C15.1 53.72,27.99 C16.1 IC4.1
N$7
  Top 0.406: C1.1 R1.2 72.59,17.91 71.88,18.37 68.58,18.37 67.82,17.86 67.82,17.25 R2.1
N$8
  Top 0.406: R2.2 65.48,15.23 ICSP.1 68.31,12.4 87.86,12.4 89,13.54 IC1.1
N$9
  Top 1.27: CON1.8 39.77,23.98 42.39,23.98 | 42.39,23.98 D1.C | 42.39,23.98 40.11,26.27 40.11,28.02 41.49,29.4 C8.1 42.9,30.3 D2.A
  Bottom 1.27: CON1.8 35.23,28.53 33.82,28.53 CON1.4 30.15,28.53 23.66,28.53 CON2.8 19.99,28.53 18.58,28.53 CON2.4 14.91,28.53 12.68,28.53 9.63,25.48 9.63,22.94 11.41,20.91 13.97,20.91 CON2A.2
N$10
  Top 0.406: ICSP.4 75.17,13.16 77.7,13.16 78.08,13.54 IC1.28
N$11
  Top 0.406: IC5.2 86.56,30.43 89.48,27.51 IC1.12
N$12
  Top 0.61: IC1.3 91.98,16.08 94.46,13.54 94.7,13.54 R3.2
N$13  (via drill 0.6)
  Top 1.016: D3.3 47.18,13.58 v47.22,13.54 | C8.2
  Top 1.27: C8.2 L2.2 45.7,26.11 45.7,21.13 D1.A
  Top 1.524: CON1.7 36.36,24.15 42.14,18.37 42.88,18.37 D1.A
  Bottom 1.016: 22.27,22.43 22.35,22.3 | 20.63,24.15 CON2.7
  Bottom 1.27: CON2A.1 20.09,20.25 22.27,22.43 | CON2.7 CON2.5 | 20.63,24.15 22.35,22.3 31.41,22.3 CON1.5 CON1.7 36.61,24.15 v47.22,13.54
N$14
  Top 0.406: ICSP.5 76.64,14.81 IC1.27
N$15
  Top 0.61: IC1.10 93.19,24.97 C3.1 97.26,25.61 Y1.2
N$16  (via drill 0.5 pad 1.02)
  Top 0.61: IC1.2 88.37,14.81 v87.86,14.3
  Top 0.813: v56.21,37.49 R5.2 C7.1 48.49,37.54 R4.2
  Bottom 0.305: v87.86,14.3 79.48,14.3 56.72,37.06 v56.21,37.49
N$17
  Top 0.508: 26.09,40.46 26.43,40.46 IC3.6
  Top 0.61: 23.8,40.36 C11.1 | D6.C 19.86,40.01
  Top 1.27: L4.2 19.51,40.36 D6.C 19.92,40.46 23.7,40.46 23.8,40.36 | C11.1 23.73,40.46 26.09,40.46
N$18
  Top 0.406: IC5.1 85.29,30.43 89.48,26.24 IC1.11
N$19
  Top 0.406: IC5.3 87.83,30.43 89.48,28.78 IC1.13
N$20
  Top 0.508: IC3.3 28.36,36.97
  Top 0.61: R7.2 R6.2 34.8,34.09 33.25,35.64 29.69,35.64 28.36,36.97
N$21
  Top 2.5: K1.12 10.14,82.37 CON3.2
  Bottom 2.5: K1.12 10.14,82.37 CON3.2
N$22
  Top 0.406: IC5.4 89.1,30.43 89.48,30.05 IC1.14
N$23
  Top 0.61: D4.A 31.09,34.06 D5.2
N$24
  Top 0.406: IC5.5 90.37,34.9 89.97,35.31 84.66,35.31 84.36,35 84.36,32.08 82.32,30.05 IC1.15
N$25
  Top 2.5: K2.12 25.12,82.12 CON4.2
  Bottom 2.5: K2.12 25.12,82.12 CON4.2
N$26
  Top 2.5: K3.12 CON5.2
  Bottom 2.5: K3.12 CON5.2
N$27
  Top 0.711: 59.03,15.06 58.29,15.8 57.13,15.8
  Top 0.813: D3.1 43.85,15 47.93,15 49.65,13.29 54.59,13.29 57.13,15.8 | 59.03,15.06 IC2.6
  Top 1.27: CON2.2 16.04,28.53 27.61,28.53 CON1.2 | D3.1 37.09,14.53 35.12,16.5 CON1A.1
  Bottom 0.61: CON1A.1 29.87,14.81 20.8,14.81 17.38,18.24 17.38,20.78 15.72,22.43 12.17,22.43 11.15,23.45 11.15,24.97 12.93,26.75 14.15,26.75 CON2.2
N$28
  Top 2.5: K4.12 60.94,81.1 CON6.2
  Bottom 2.5: K4.12 60.94,81.1 CON6.2
N$29
  Top 2.5: K5.12 77.19,81.61 CON7.2
  Bottom 2.5: K5.12 77.19,81.61 CON7.2
N$30
  Top 2.2: K1.11 14.71,60.66
  Top 2.5: CON3.1 R20.1 2.77,67.9 4.55,64.59 14.71,60.66
  Bottom 2.2: K1.11 14.71,60.66
  Bottom 2.5: CON3.1 R20.1 2.77,67.9 4.55,64.59 14.71,60.66
N$31
  Top 2.5: K6.12 93.19,82.63 CON8.2
  Bottom 2.5: K6.12 93.19,82.63 CON8.2
N$32
  Top 2.5: K1.14 R20.2 CON3.3
  Bottom 2.5: K1.14 R20.2 CON3.3
N$38
  Top 0.508: IC3.1 26.46,37.07
  Top 0.61: 29.14,34.55 D5.1 29.14,34.39 26.46,37.07 | IC3.1 26.3,38.05 C11.2
N$40
  Top 0.61: IC1.9 93.19,23.7 C2.1 96.24,23.06 Y1.1
N$45
  Top 0.406: IC1.16 79.91,28.78 79.4,29.29 79.4,30.56 83.54,34.7 83.54,35.38 84.2,36.04 90.45,36.04 91.64,34.85 IC5.6
N$46
  Top 0.406: IC6.1 65.64,29.11 67.78,26.97 78.73,26.97 79.28,27.51 IC1.17
N$47
  Top 0.406: IC1.18 67.29,26.24 64.59,28.93 64.59,32.03 64.9,32.34 66.42,32.34 66.91,31.85 IC6.2
N$51
  Top 2.5: K2.14 R21.2 CON4.3
  Bottom 2.5: K2.14 R21.2 CON4.3
N$52
  Top 2.5: K3.14 R22.2 CON5.3
  Bottom 2.5: K3.14 R22.2 CON5.3
N$53
  Top 2.5: K4.14 R23.2 CON6.3
  Bottom 2.5: K4.14 R23.2 CON6.3
N$54
  Top 2.5: K5.14 R24.2 CON7.3
  Bottom 2.5: K5.14 R24.2 CON7.3
N$55
  Top 2.5: K6.14 R25.2 CON8.3
  Bottom 2.5: K6.14 R25.2 CON8.3
N$56
  Top 0.813: IC1.6 91.92,19.89 94.77,17.05 C4.1
N$57
  Top 2.2: K2.11 31.22,60.66
  Top 2.5: CON4.1 R21.1 19.28,67.9 20.8,64.85 31.22,60.66
  Bottom 2.2: K2.11 31.22,60.66
  Bottom 2.5: CON4.1 R21.1 19.28,67.9 20.8,64.85 31.22,60.66
N$58
  Top 2.3: K3.11 47.68,60.58
  Top 2.5: CON5.1 R22.1 36.04,68.15 37.57,64.34 47.68,60.58
  Bottom 2.3: K3.11 47.68,60.58
  Bottom 2.5: CON5.1 R22.1 36.04,68.15 37.57,64.34 47.68,60.58
N$59
  Top 2.3: K4.11 64.24,60.58
  Top 2.5: CON6.1 R23.1 52.55,68.15 53.57,65.1 64.24,60.58
  Bottom 2.3: K4.11 64.24,60.58
  Bottom 2.5: CON6.1 R23.1 52.55,68.15 53.57,65.1 64.24,60.58
N$60
  Top 2.3: K5.11 80.75,60.58
  Top 2.5: CON7.1 R24.1 69.06,68.15 70.33,64.85 80.75,60.58
  Bottom 2.3: K5.11 80.75,60.58
  Bottom 2.5: CON7.1 R24.1 69.06,68.15 70.33,64.85 80.75,60.58
N$61
  Top 2.3: K6.11 97.23,60.58
  Top 2.5: CON8.1 R25.1 85.57,67.9 86.84,64.85 97.23,60.58
  Bottom 2.3: K6.11 97.23,60.58
  Bottom 2.5: CON8.1 R25.1 85.57,67.9 86.84,64.85 97.23,60.58
N$63  (via drill 0.5 pad 1.02, 0.6)
  Top 0.61: v68.17,28.14 IC6.3 | v83.29,22.43 IC1.21
  Bottom 0.61: v83.29,22.43 73.38,22.43 68.17,27.64 v68.17,28.14
N$64  (via drill 0.5 pad 1.02, 0.6)
  Top 0.61: v84.56,21.16 IC1.22 | IC6.4 69.44,28.53 v69.7,28.14
  Bottom 0.61: v84.56,21.16 84.56,22.94 83.8,23.7 73.64,23.7 69.7,27.64 v69.7,28.14
N$65  (via drill 0.5 pad 1.02, 0.6)
  Top 0.61: IC1.25 v85.83,17.35 | IC6.5 70.72,28.88 v71.22,28.14
  Bottom 0.61: v85.83,17.35 85.83,23.19 84.05,24.97 73.89,24.97 71.22,27.64 v71.22,28.14
N$66  (via drill 0.5 pad 1.02, 0.6)
  Top 0.61: IC1.26 v87.1,16.08 | IC6.6 71.98,29.29 v72.75,28.14
  Bottom 0.61: v87.1,16.08 87.07,23.57 84.4,26.24 74.14,26.24 72.75,27.64 v72.75,28.14

### Text on the board
Dimension: 86.5 | 103
tPlace: pcb rev2 | +24V | GND | CANH | CANL
bPlace: C | NC | NO | C | NC | NO | C | NC | NO | C | NC | NO | C | NC | NO | C | NC | NO | CH1 | CH2 | CH3 | CH4 | CH5 | CH6 | UNIV 3.2.(1-2).x -rev2 | Mono & bistable 5A relay node | hapcan.com